# EAGLE design SenseLoRa Industrial-grade Air Monitor V1.0 (EAGLE 6.1)
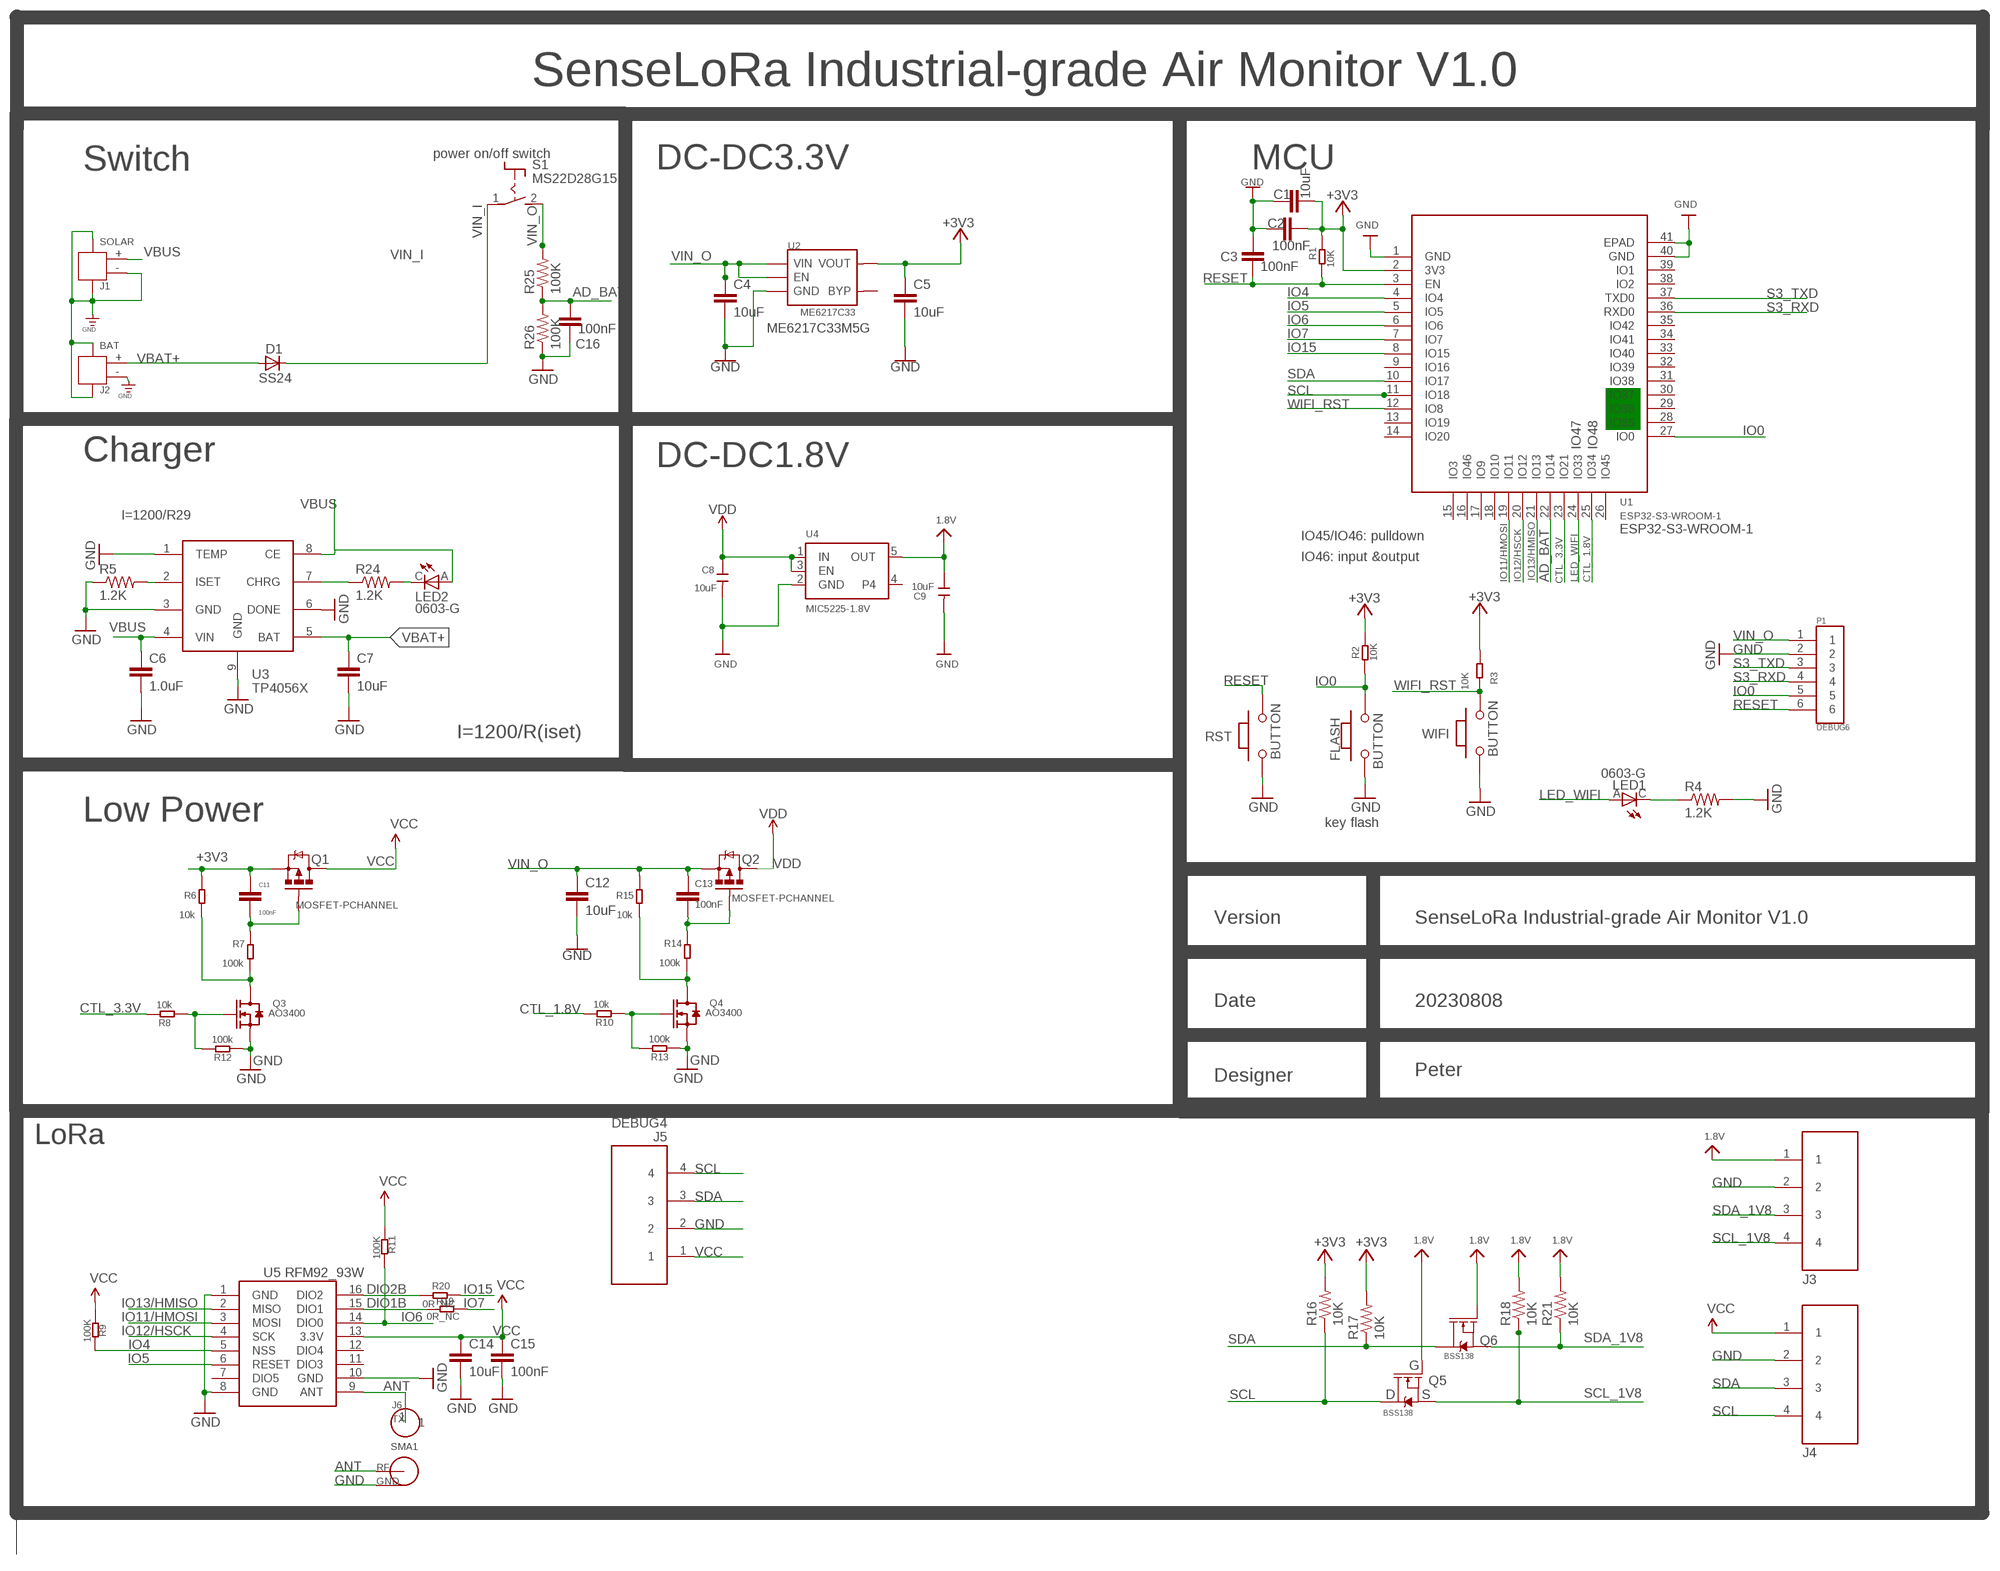
[diagram p0: schematic, sheet 1]

## Parts
C1  10uF  C0603  [C0603]
C2  100nF  C0603  [C0603]
C3  100nF  C0603  [C0603]
C4  10uF  C0603  [C0603]
C5  10uF  C0603  [C0603]
C6  1.0uF  C0603  [C0603]
C7  10uF  C0603  [C0603]
C8  10uF  C-0603  [0603]
C9  10uF  C-0603  [0603]
C11  100nF  C0603  [C0603]
C12  10uF  C0603  [C0603]
C13  100nF  C0603  [C0603]
C14  10uF  C0603  [C0603]
C15  100nF  C0603  [C0603]
C16  100nF  C0603  [C0603]
D1  SS24  DIODE-DO-214AC  [DO-214AC]
FLASH  BUTTON  PB157  [157SW]
J1  SOLAR  JST-2P-SMD'2.0'  [HW2-SMD-2.0-90D]
J2  BAT  JST-2P-SMD'2.0'  [HW2-SMD-2.0-90D]
J3  CONNNECT-SMD-1.25X4P  [CONNNECT-SMD-1.25X4P]
J4  CONNNECT-SMD-1.25X4P  [CONNNECT-SMD-1.25X4P]
J5  DEBUG4  [DEBUG*4]
J6  TX  HEADER-1P-50  [1P-100/50MIL]
LED1  0603-G  LED0603  [LED0603]
LED2  0603-G  LED0603  [LED0603]
P1  DEBUG6  [DEBUG*6]
Q1  MOSFET-PCHANNEL  [SOT23-3]
Q2  MOSFET-PCHANNEL  [SOT23-3]
Q3  AO3400  MOSFET-N'SOT23'  [SOT23@1]
Q4  AO3400  MOSFET-N'SOT23'  [SOT23@1]
Q5  BSS138  MOSFET-NCH-BSS138  [SOT23-3]
Q6  BSS138  MOSFET-NCH-BSS138  [SOT23-3]
R1  10K  R-0603  [R0603]
R2  10K  R-0603  [R0603]
R3  10K  R-0603  [R0603]
R4  1.2K  R0603  [R0603]
R5  1.2K  R0603  [R0603]
R6  10k  R-0603  [R0603]
R7  100k  R-0603  [R0603]
R8  10k  R-0603  [R0603]
R9  100K  R-0603  [R0603]
R10  10k  R-0603  [R0603]
R11  100K  R-0603  [R0603]
R12  100k  R-0603  [R0603]
R13  100k  R-0603  [R0603]
R14  100k  R-0603  [R0603]
R15  10k  R-0603  [R0603]
R16  10K  R0603  [R0603]
R17  10K  R0603  [R0603]
R18  10K  R0603  [R0603]
R19  0R_NC  R-0603  [R0603]
R20  0R_NC  R-0603  [R0603]
R21  10K  R0603  [R0603]
R24  1.2K  R0603  [R0603]
R25  100K  R0603  [R0603]
R26  100K  R0603  [R0603]
RST  BUTTON  PB157  [157SW]
S1  MS22D28G15  [S-MS22D28G15]
SMA1  SMA-KWE  [SMA-KWE]
U1  ESP32-S3-WROOM-1  ESP32­S2­SOLO  [ESP32-­S2-­SOLO]
U2  ME6217C33  SPX3819  [SOT23-5]
U3  TP4056X  TP4056  [SOP8-1.27P]
U4  MIC5225-1.8V  VREG_SOT23-5  [SOT23-5]
U5  RFM92_93W  [RFM92_93W]
WIFI  BUTTON  PB157  [157SW]

## Nets
1.8V: C9.1 J3.1 Q5.1(G) Q6.1(G) R18.2 R21.2 U4.5(OUT)
+3V3: C1.2 C2.2 C5.1 C11.1 Q1.2(S) R1.2 R2.2 R3.2 R6.2 R16.2 R17.2 U1.2(3V3) U2.5(VOUT)
AD_BAT: C16.2 R25.1 R26.2 U1.22(IO14)
ANT: J6.1 SMA1.1(SIG) U5.9(ANT)
CTL_1.8V: R10.2 U1.25(IO34)
CTL_3.3V: R8.2 U1.23(IO21)
DIO1B: R19.2 U5.15(DIO1)
DIO2B: R20.2 U5.16(DIO2)
GND: C1.1 C2.1 C3.2 C4.2 C5.2 C6.2 C7.2 C8.2 C9.2 C12.2 C14.2 C15.2 C16.1 FLASH.1 J1.3 J1.4 J1.- J2.3 J2.4 J2.- J3.2 J4.2 J5.2 P1.2 Q3.2(S) Q4.2(S) R4.2 R5.1 R12.1 R13.1 R26.1 RST.1 SMA1.2(GND) SMA1.3(GND) SMA1.4(GND) SMA1.5(GND) U1.1(GND) U1.40(GND) U1.41(EPAD) U2.2(GND) U3.1(TEMP) U3.3(GND) U3.6(DONE) U3.9(GND) U4.2(GND) U5.1(GND) U5.8(GND) U5.10(GND) WIFI.1
IO0: FLASH.2 P1.5 R2.1 U1.27(IO0)
IO4: R9.1 U1.4(IO4) U5.5(NSS)
IO5: U1.5(IO5) U5.6(RESET)
IO6: R11.1 U1.6(IO6) U5.14(DIO0)
IO7: R19.1 U1.7(IO7)
IO11/HMOSI: U1.19(IO11) U5.3(MOSI)
IO12/HSCK: U1.20(IO12) U5.4(SCK)
IO13/HMISO: U1.21(IO13) U5.2(MISO)
IO15: R20.1 U1.8(IO15)
ISET: R5.2 U3.2(ISET)
LED_WIFI: LED1.A U1.24(IO33)
N$1: LED1.C R4.1
N$4: R24.1 U3.7(CHRG)
N$5: LED2.C R24.2
N$11: C13.2 Q2.1(G) R14.2
N$12: Q4.1(G) R10.1 R13.2
N$13: C11.2 Q1.1(G) R7.2
N$14: Q3.1(G) R8.1 R12.2
N$18: Q3.3(D) R6.1 R7.1
N$31: Q4.3(D) R14.1 R15.1
RESET: C3.1 P1.6 R1.1 RST.2 U1.3(EN)
S3_RXD: P1.4 U1.36(RXD0)
S3_TXD: P1.3 U1.37(TXD0)
SCL: J4.4 J5.4 Q5.3(D) R16.1 U1.11(IO18)
SCL_1V8: J3.4 Q5.2(S) R18.1
SDA: J4.3 J5.3 Q6.3(D) R17.1 U1.10(IO17)
SDA_1V8: J3.3 Q6.2(S) R21.1
VBAT+: C7.1 D1.A J2.+ U3.5(BAT)
VBUS: C6.1 J1.+ LED2.A U3.4(VIN) U3.8(CE)
VCC: C14.1 C15.1 J4.1 J5.1 Q1.3(D) R9.2 R11.2 U5.13(3.3V)
VDD: C8.1 Q2.3(D) U4.1(IN) U4.3(EN)
VIN_I: D1.C S1.1(P)
VIN_O: C4.1 C12.1 C13.1 P1.1 Q2.2(S) R15.2 R25.2 S1.2(S) U2.1(VIN) U2.3(EN)
WIFI_RST: R3.1 U1.12(IO8) WIFI.2
Unconnected: U1.9(IO16) U1.13(IO19) U1.14(IO20) U1.15(IO3) U1.16(IO46) U1.17(IO9) U1.18(IO10) U1.26(IO45) U1.28(IO35) U1.29(IO36) U1.30(IO37) U1.31(IO38) U1.32(IO39) U1.33(IO40) U1.34(IO41) U1.35(IO42) U1.38(IO2) U1.39(IO1) U2.4(BYP) U4.4 U5.7(DIO5) U5.11(DIO3) U5.12(DIO4)

## Notes on the sheet
- SenseLoRa Industrial-grade Air Monitor V1.0
- power on/off switch
- Switch | DC-DC3.3V | MCU
- ME6217C33M5G
- IO47 | IO48
- Charger | DC-DC1.8V
- I=1200/R29
- ESP32-S3-WROOM-1
- IO45/IO46: pulldown
- IO46: input &output
- I=1200/R(iset)
- Low Power
- key flash
- Version | SenseLoRa Industrial-grade Air Monitor V1.0
- Date | 20230808
- Peter
- Designer
- LoRa
- G
- D | S

## Library data of the parts
C1-C7 C11-C16 = Makerfabs-Peter:C0603
C8 C9 = Discrete:C*: Ceramic Capacitors
D1 = diode:DIODE-: DIODE
FLASH RST WIFI = MySMD:PB157
J1 J2 = Connector-new:JST-2P-SMD: 2P-SMD-1.0-90D:320110054;2P-SMD-2.0-90D:320110026
J3 J4 = Makerfabs-Peter:CONNNECT-SMD-1.25X4P
J5 = Makerfabs-Peter:DEBUG*4
J6 = Connector:HEADER-1P
LED1 LED2 = Makerfabs-Peter:LED0603
P1 = Makerfabs-Peter:DEBUG*6
Q1 Q2 = User-Submitted:MOSFET-PCHANNEL: Generic PMOSFET IRLML2244 - TRANS-11153 (SOT-23 -20V -4.3A) (1.Gate 2.Source 3.Drain) FQP27P06 - COM-10349 <http://www.sparkfun.com/products/10349> (TO-220 -60V -27A) (1.Gate 2.Source 3.Drain); PROD_ID: TRANS-08285
Q3 Q4 = Discrete:MOSFET-N: IRLL014: http://www.vishay.com/docs/91319/sihll014.pdf
Q5 Q6 = SparkFun-DiscreteSemi:MOSFET-NCH: N-channel MOSFETs Voltage controlled devices that allow control of high current outputs. SparkFun Products: SparkFun OpenScale <https://www.sparkfun.com/products/13261> SparkFun Digital Sandbox <https://www.sparkfun.com/products/12651> SparkFun Monster Moto Shield <https://www.sparkfun.com/products/10182> SparkFun MOSFET Power Controller <https://www.sparkfun.com/products/11214>; PROD_ID: TRANS-00830; VALUE: 220mA/50V/3.5Ω
R1-R3 R6-R15 R19 R20 = Discrete:R*
R4 R5 R16-R18 R21 R24-R26 = Makerfabs-Peter:R0603
S1 = Makerfabs-Peter:MS22D28G15
SMA1 = dragino:SMA-KWE
U1 = self:ESP32­S2­SOLO
U2 = IC:SPX3819
U3 = self:TP4056
U4 = microbuilder:VREG_SOT23-5: SOT23-5 Fixed Voltage Regulators Part Current Out V Out V In V Dropout θJA (°C/W) TJ (°C) Digikey Part No. ADP121 150mA 3.3V 3.4-5.5V 0.09V @ 150mA -- -- ADP121-AUJZ33R7CT-ND ADP121 150mA 3.0V 3.1-5.5V 0.09V @ 150mA -- -- ADP121-AUJZ30R7CT-ND ADP122 300mA 3.3V 3.4-5.5V 0.085V @ 300mA -- -- ADP122AUJZ-3.3-R7CT-ND ADP1712 300mA 3.3V 3.5-5.5V 0.17V @ 300mA -- -- ADP1712AUJZ-3.3-R7TR-ND AP7311 (Low Cost) 150mA 3.3V 3.5-6V 0.15V @ 150mA -- -- AP7311-33WG-7DICT-ND LD39015M18R 150mA 1.8V 1.9V-5.5V 0.08V @ 100mA -- -- 497-6977-1-ND LP2985A-33DBVR 150mA 3.3V 3.3-16V 0.28V @ 150mA 206 150 296-18479-1-ND MCP1824T-3302E/OT 300mA 3.3V 3.5V-6V 0.2V @ 300mA -- -- MCP1824T-3302E/OTCT-ND MIC5205-2.5YM5 TR 150mA 2.5V 2.7-16V 0.165V @ 150mA -- -- 576-1257-2-ND MIC5205-3.0YM5 TR 150mA 3.0V 3.2V-16V 0.165V @ 150mA -- -- 576-1258-2-ND MIC5205-3.3YM5 TR 150mA 3.3V 3.5V-16V 0.165V @ 150mA -- -- 576-1259-2-ND TPS780330220 150mA 3.3V+2.2V 3.6-5.5V 250mV Max -- -- 296-23332-1-ND TDA3663/N1,135 100mA 3.3V 3.5-45V 0.18V @ 50mA -- -- 568-5343-1-ND Max operating temp can be calculated using θJA, TJ (max junction temperature), and power in watts. Set the "Maximum Ambient Temperature" until it reaches TJ ("Max Junction Temperature"), which is the absolute limit for safe use of the regulator: Heat Sink Temperature Calculator <http://www.daycounter.com/Calculators/Heat-Sink-Temperature-Calculator.phtml> For example, With 12V source into a 3.3V LP2985 and a 30mA load, we are dissipating (12V-3.3V) * 0.03A = 0.261W. With a θJA of 206 °C/W, a TJ of 150°C, and 261mW we can safely use the chip without a heat sink up to 75°C (=147.1°C Junction Temperature).
U5 = dragino:RFM92_93W

## Net classes
0 default: width 0.152 mm, drill 0.254 mm, clearance 0.152 mm

## Board
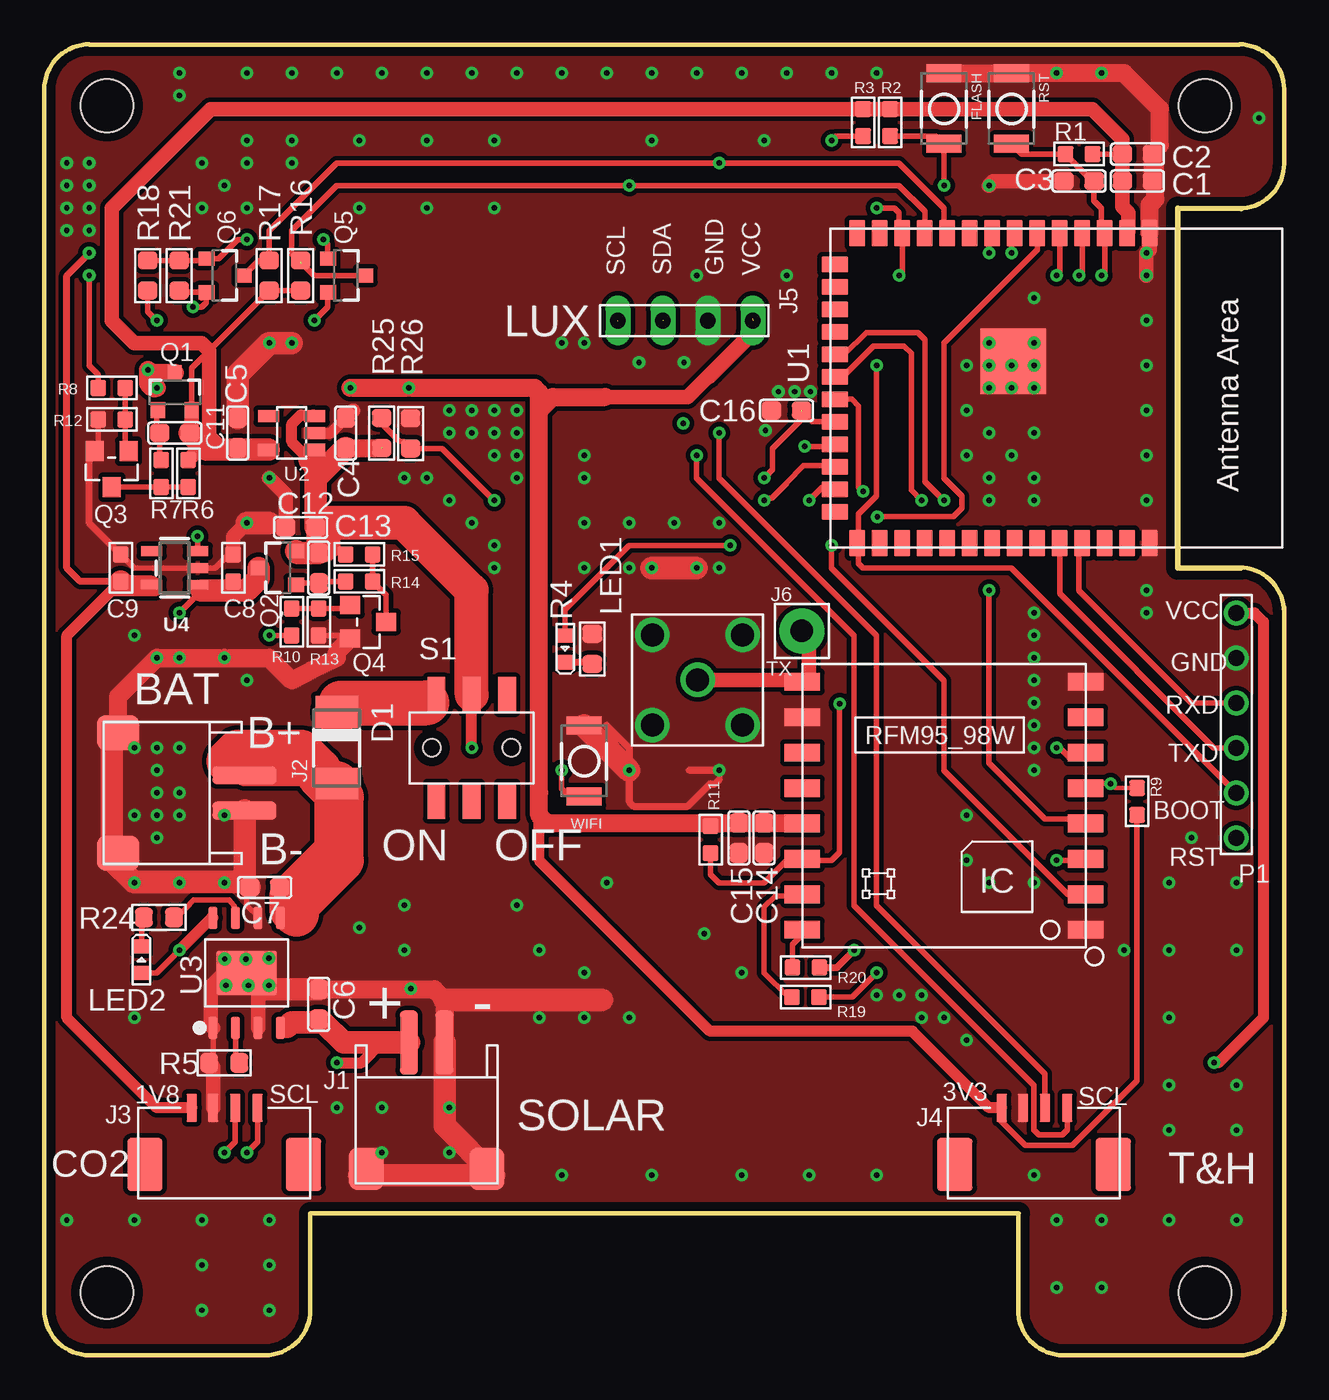
[diagram p1: board, top side]
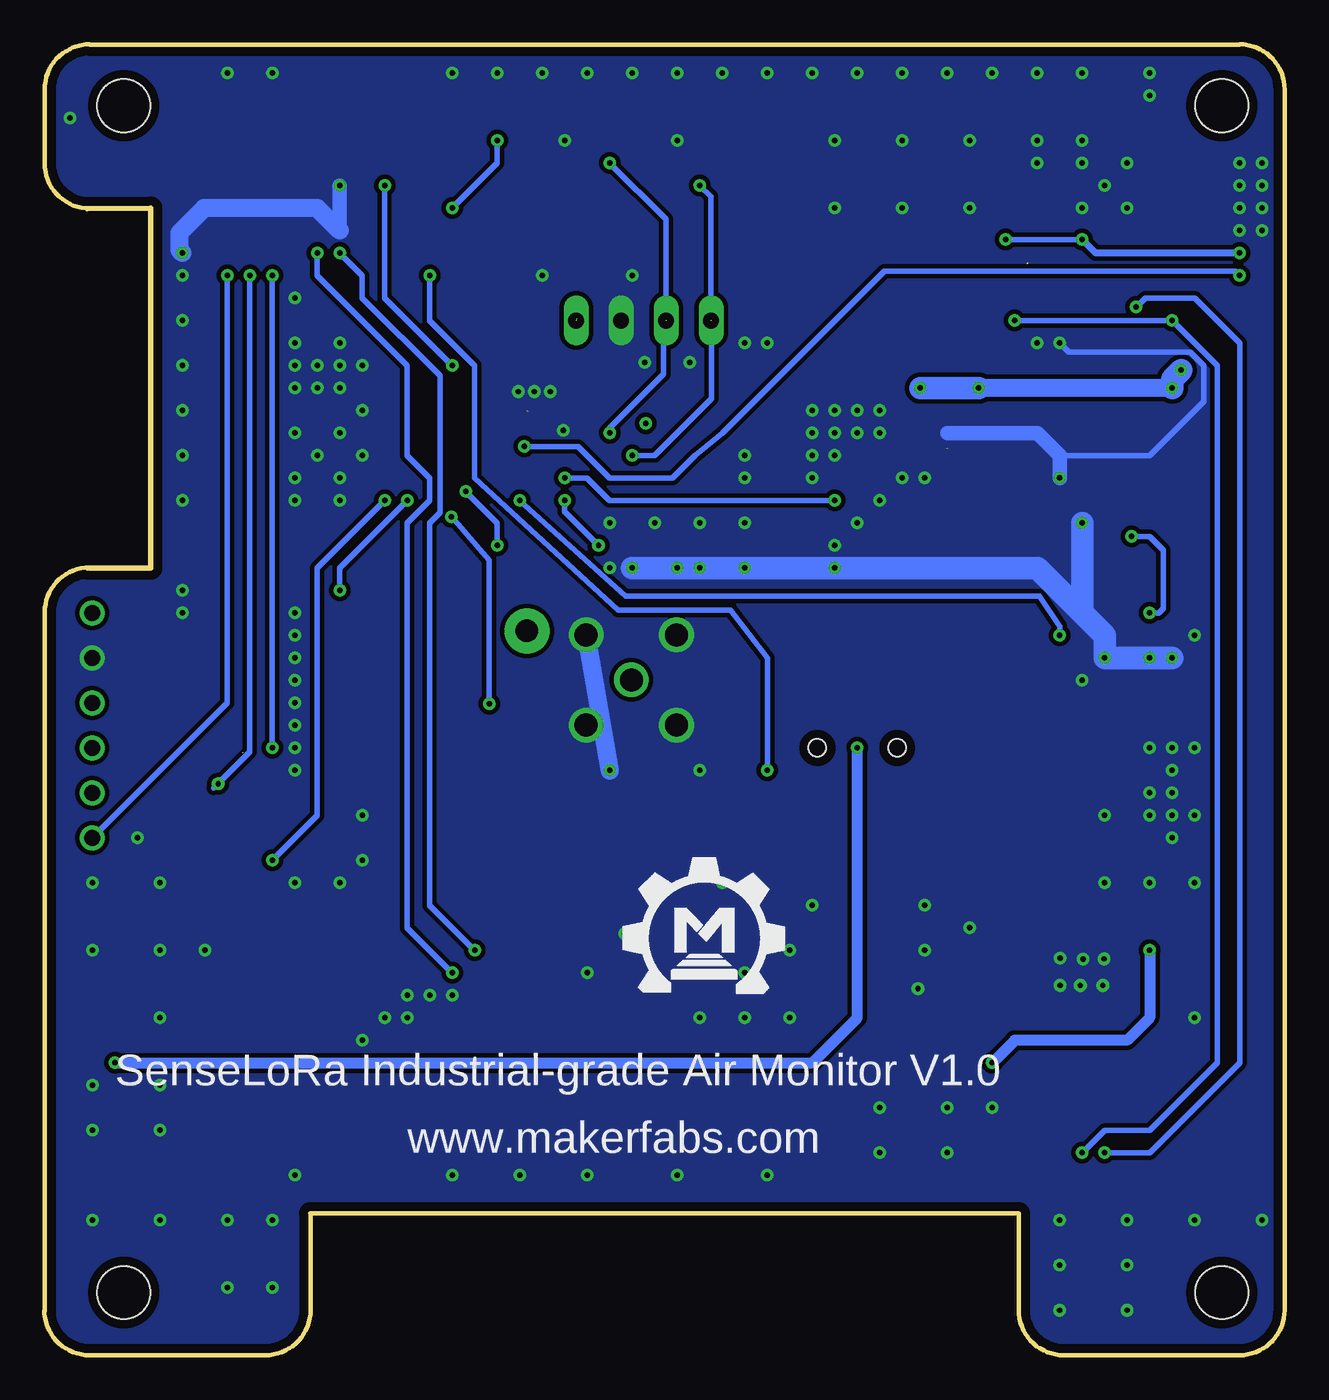
[diagram p2: board, bottom side, seen from below]

Size 70.03 x 74.02 mm. Coordinates in mm from the lower left corner, seen from the top.
Outline: 67.46,74 2.54,74
Outline: 70.03,2.54 arc-90 67.49,0 57.53,0 arc-90 54.99,2.54
Outline: 70,71.48 arc90 67.46,74.02
Outline: 2.54,74.02 arc90 0,71.48 0,2.54 arc90 2.54,0 12.47,0 arc90 15.01,2.54
Outline: 70,42.24 70,2.49
Outline: 15,2.54 15,8
Outline: 55,2.54 55,8
Outline: 15.03,8 55.02,8
Outline: 67.59,64.75 64.01,64.77 64.01,44.45 67.56,44.45
Outline: 67.46,64.75 arc90 70,67.28
Outline: 70,41.94 arc90 67.46,44.48
Outline: 70,71.45 70,67.26
Copper layers (1*16): Top 0.035mm / dielectric 1.5mm / Bottom 0.035mm
Design rules: minimum track width 8mil, minimum drill 12mil, track to track 8mil, track to pad 8mil, pad to pad 8mil, via to via 8mil, smd to smd 0mil, copper to edge 20mil, drill to drill 8mil, minimum pad ring 10mil, minimum via ring 8mil, stop-mask expansion 0mil, vias tented up to drill 30mil, thermal gap 0mil
Holes 3 mm at 3.54,3.54 65.54,3.54 3.54,70.54 65.54,70.54

### Footprints (pad centres in the part's own frame; a part is rotated, then mirrored left to right if it is on the bottom)
C0603 = smd 1.1 x 1: 1 -0.85,0; 2 0.85,0
0603 = smd 0.889 x 0.889: 1 -0.762,0; 2 0.762,0
DO-214AC = smd 1.8 x 2.4: A 2.025,0; C -2.025,0
157SW = smd 1.016 x 1.981: 1 0,0; 2 4,0
HW2-SMD-2.0-90D = smd 2 x 2.4: 3 3.4,-2.181; 4 -3.4,-2.181 | smd 1 x 3.6: + -1,4.953; - 1,4.953
CONNNECT-SMD-1.25X4P = smd 0.6 x 1.6: 1 -1.825,2.54; 2 -0.625,2.54; 3 0.625,2.54; 4 1.875,2.54 | smd 2 x 3: 5 4.475,-0.66; 6 -4.475,-0.66
DEBUG*4 = drill 0.9 long: 1 0,0; 2 0,-2.54; 3 0,-5.08; 4 0,-7.62
1P-100/50MIL = drill 1.27 pad 2.54: 1 0,0
LED0603 = smd 0.8 x 0.8: A -0.75,0; C 0.75,0
DEBUG*6 = drill 0.9: 1 0,0; 2 0,2.54; 3 0,5.08; 4 0,7.62; 5 0,10.16; 6 0,12.7
SOT23-3 = smd 0.8 x 0.9: 1 -0.95,-1; 2 0.95,-1; 3 0,1.1
SOT23@1 = smd 1.016 x 1.143: 1 -0.95,-1.016; 2 0.95,-1.016; 3 0,1.016
R0603 = smd 0.889 x 0.889: 1 -0.762,0; 2 0.762,0
R0603' = smd 1 x 1.1: 1 -0.85,0; 2 0.85,0
S-MS22D28G15 = smd 1 x 2: 1 -2,3; 2 0,3; 3 2,3; 4 2,-3; 5 0,-3; 6 -2,-3 | hole 1: 2.25,0; -2.25,0
SMA-KWE = drill 1.3: 1 0,0; 2 -2.55,2.55; 3 2.55,2.55; 4 -2.55,-2.55; 5 2.55,-2.55
ESP32-­S2-­SOLO = smd 1.5 x 0.9: 1 -8.75,5.26; 2 -8.75,3.99; 3 -8.75,2.72; 4 -8.75,1.45; 5 -8.75,0.18; 6 -8.75,-1.09; 7 -8.75,-2.36; 8 -8.75,-3.63; 9 -8.75,-4.9; 10 -8.75,-6.17; 11 -8.75,-7.44; 12 -8.75,-8.71; 13 -8.75,-9.98; 14 -8.75,-11.25; 27 8.75,-11.25; 28 8.75,-9.98; 29 8.75,-8.71; 30 8.75,-7.44; 31 8.75,-6.17; 32 8.75,-4.9; 33 8.75,-3.63; 34 8.75,-2.36; 35 8.75,-1.09; 36 8.75,0.18; 37 8.75,1.45; 38 8.75,2.72; 39 8.75,3.99; 40 8.75,5.26 | smd 0.9 x 1.5: 15 -6.985,-12.5; 16 -5.715,-12.5; 17 -4.445,-12.5; 18 -3.175,-12.5; 19 -1.905,-12.5; 20 -0.635,-12.5; 21 0.635,-12.5; 22 1.905,-12.5; 23 3.175,-12.5; 24 4.445,-12.5; 25 5.715,-12.5; 26 6.985,-12.5 | smd 3.7 x 3.7: 41 -1.5,-2.46
SOT23-5 = smd 0.69 x 1.2: 1 -0.95,-1.3; 2 0,-1.3; 3 0.95,-1.3; 4 0.95,1.3; 5 -0.95,1.3
SOP8-1.27P = smd 1.27 x 0.51: 1 -3.1,1.905; 2 -3.1,0.635; 3 -3.1,-0.635; 4 -3.1,-1.905; 5 3.1,-1.905; 6 3.1,-0.635; 7 3.1,0.635; 8 3.1,1.905 | smd 2.5 x 3.4: 9 0,0
SOT23-5' = smd 0.55 x 1.2: 1 -0.95,-1.3; 2 0,-1.3; 3 0.95,-1.3; 4 0.95,1.3; 5 -0.95,1.3
RFM92_93W = smd 2 x 1: 1 -8,7; 2 -8,5; 3 -8,3; 4 -8,1; 5 -8,-1; 6 -8,-3; 7 -8,-5; 8 -8,-7; 9 8,-7; 10 8,-5; 11 8,-3; 12 8,-1; 13 8,1; 14 8,3; 15 8,5; 16 8,7

### Placement (x,y rotation side)
C1  61.72,66.29 180 top
C2  61.72,67.82 180 top
C3  58.42,66.29 180 top
C4  17.02,52.07 90 top
C5  10.92,52.07 90 top
C6  15.49,19.81 90 top
C7  12.45,26.42 180 top
C8  10.67,44.45 90 top
C9  4.32,44.45 90 top
C11  7.37,52.07 180 top
C12  14.48,46.74 180 top
C13  15.49,44.45 270 top
C14  40.64,29.21 270 top
C15  39.22,29.21 270 top
C16  41.91,53.34 0 top
D1  16.51,34.29 270 top
FLASH  50.8,72.39 270 top
J1  21.59,12.7 0 top
J2  6.35,31.75 270 top
J3  10.16,11.43 0 top
J4  55.88,11.43 0 top
J5  40,58.42 270 top
J6  42.77,40.89 0 top
LED1  29.41,39.88 270 top
LED2  5.49,22.33 90 top
P1  67.31,41.91 180 top
Q1  7.37,54.36 0 top
Q2  13.21,44.45 90 top
Q3  3.81,50.04 180 top
Q4  18.29,41.4 270 top
Q5  17.02,60.96 270 top
Q6  10.16,60.96 270 top
R1  58.42,67.82 0 top
R2  47.75,69.6 90 top
R3  46.23,69.6 90 top
R4  1.2K  [R0603']  30.94,39.88 90 top
R5  1.2K  [R0603']  10.16,16.51 0 top
R6  8.13,49.78 90 top
R7  6.6,49.78 90 top
R8  3.81,54.61 180 top
R9  61.7,31.27 270 top
R10  13.97,41.4 270 top
R11  37.62,29.11 90 top
R12  3.81,52.83 0 top
R13  15.49,41.4 90 top
R14  17.78,43.69 180 top
R15  17.78,45.21 180 top
R16  10K  [R0603']  14.48,60.96 270 top
R17  10K  [R0603']  12.7,60.96 270 top
R18  10K  [R0603']  5.84,60.96 90 top
R19  42.98,20.22 180 top
R20  43,21.89 180 top
R21  10K  [R0603']  7.62,60.96 90 top
R24  1.2K  [R0603']  6.48,24.71 180 top
R25  100K  [R0603']  19.05,52.07 270 top
R26  100K  [R0603']  20.68,52.04 270 top
RST  54.61,72.39 270 top
S1  24.13,34.29 0 top
SMA1  36.88,38.13 0 top
U1  57.15,54.61 270 top
U2  13.97,52.07 90 top
U3  11.43,21.59 90 top
U4  MIC5225-1.8V  [SOT23-5']  7.37,44.45 90 top
U5  50.8,31.02 180 top
U$2  [MAKERFABS_0.3]  36.89,20.48 0 bottom
WIFI  30.48,35.56 270 top

### Tracks (layer width: path | path; a pad name or v marks a point on that pad's centre or on a via)
1.8V  (via drill 0.3)
  Top 0.203: U4.5 6.07,43.46 6.35,43.18
  Top 0.305: R18.2 R21.2 9.06,61.81 Q6.1 9.84,61.91 10.92,62.99 v11.43,62.99 | v15.75,62.99 16,62.74 16,61.98 16.02,61.96 Q5.1
  Top 0.406: C9.1 2.03,43.69 1.27,44.45 1.27,60.96 v2.54,62.23
  Top 0.61: J3.1 6.35,13.97 1.27,19.05 1.27,40.64 3.81,43.18 6.35,43.18
  Top 1.016: U4.5 4.51,43.5
  Top 1.27: 4.51,43.5 C9.1
  Bottom 0.305: v11.43,62.99 v15.75,62.99
  Bottom 0.406: v2.54,62.23 10.67,62.23 v11.43,62.99
+3V3
  Top 0.305: C5.1 10.5,50.8 8.89,50.8 8.32,51.37 Q1.2 8.32,55.73 9.31,56.73 R17.2 R16.2 | U1.2 61.1,63.36 60.96,63.5 60.96,64.77 60.96,66.21 C1.2 | C2.2 R1.2
  Top 0.813: 9.17,51.12 8.7,51.12 R6.2 | Q1.2 8.32,52.17 C11.1 | U1.2 61.21,63.43 61.21,64.52 60.96,64.77 60.87,64.86 C1.2 C2.2 60.87,68.67 59.18,70.36 R2.2 R3.2 9.4,70.36 3.81,64.77 3.81,58.42 5.08,57.15 8.89,57.15 9.31,56.73 9.31,51.9 9.91,51.31
  Top 1.27: U2.5 9.17,51.12 C11.1
AD_BAT  (via drill 0.3)  (1 unrouted)
  Top 0.305: U1.22 43.33,52.7 42.72,53.31 | C16.2 42.76,52.82 41.12,51.18 41.12,50.01 v40.64,49.53 | R25.1 19.1,52.55 20.04,51.61 20.28,51.59 R26.2 22.46,51.2 v25.4,48.26
  Bottom 0.305: v40.64,49.53 39.37,49.53 38.1,48.26 v25.4,48.26
ANT
  Top 0.203: U5.9 42.85,38.02 42.95,38.12 | 42.72,41.02 42.72,40.95 J6.1
  Top 0.813: SMA1.1 42.95,38.12 43.16,38.12 43.18,38.1 43.18,40.64 43.1,40.64 42.72,41.02
CTL_1.8V  (via drill 0.3)
  Top 0.305: R10.2 v12.7,40.64 | v43.18,48.26 43.94,49.02 44.52,49.02 U1.25
  Bottom 0.305: v12.7,40.64 12.7,41.15 13.84,42.85 37.21,42.85 v43.18,48.26
CTL_3.3V  (via drill 0.3)
  Top 0.305: R8.2 3.05,55.37 2.54,55.88 v2.54,60.96 | v42.93,51.31 44.78,51.31 | 44.96,51.31 44.78,51.31 | 44.78,51.31 U1.23
  Bottom 0.305: v2.54,60.96 2.79,61.21 22.61,61.21 31.75,52.07 33.27,50.8 34.54,49.53 38.1,49.53 39.88,51.31 v42.93,51.31
DIO1B
  Top 0.305: R19.2 42.01,20.22 40.64,21.59 40.64,25.3 41.27,25.93 42.71,25.93 U5.15
DIO2B
  Top 0.203: U5.16 43.07,24.02 43.18,24.13
  Top 0.305: R20.2 42.24,23.19 43.18,24.13
GND  (via drill 0.3)
  Top 0.305: U3.1 9.53,16.73 R5.1 | U3.6 12.06,24.77 11.43,25.4 11.43,26.25 C7.2 | 10.79,22.23 U3.9 | C8.2 10.41,45.21 9.65,44.45 U4.2 5.08,44.45 C9.2 | R13.1 17.08,40.64 Q4.2 | R12.1 3.05,51.24 Q3.2 | 62.74,66.29 C1.1 62.57,66.97 62.23,67.31 62.23,66.04 62.74,66.04 62.99,66.29 62.99,68.33 | J1.4 18.69,10.52 19.05,10.16 | J1.3 25.04,10.52 25.4,10.16 | 3.81,27.94 3.81,27.99 J2.3 | C12.2 12.95,46.74 12.7,46.99 | 38.11,32.51 v38.11,33.01 v38.1,33.02
  Top 0.406: C9.2 2.54,46.99 2.54,50.73 Q3.2 | v38.1,33.02 36.41,33.02 | v33.02,33.02 31.75,35.56 33.02,34.29 v33.02,33.02 | v33.02,33.02 33.02,31.24 33.27,30.99 36.32,30.99 37.59,32.26 37.86,32.26 38.11,32.51
  Top 0.61: U2.2 16.17,52.07 C4.2
  Top 0.813: U3.3 12.06,20.95 U3.9 10.16,21.59 9.4,20.83 9.4,18.62 U3.1 | J3.2 9.54,16.29 R5.1 | C8.2 10.67,46.23 v11.43,46.99 | C12.2 13.63,48.6 v12.7,49.53 | 17.44,53.34 C4.2 | U1.1 62.41,62.41 v62.23,62.23 v62.23,60.96 | C3.2 53.59,66.29 v53.34,66.04
  Top 1.016: C6.2 22.01,20.66 22.61,20.07 22.61,17.67 J1.- | U1.1 62.41,64.95 62.74,65.28 62.74,66.29 62.74,67.65 C2.1 | J2.4 4.17,37.19 v6.35,39.37 v10.16,39.37 12.7,39.37 13.97,38.1 15.09,38.68 16.51,39.37 16.51,39.69 Q4.2 | 62.99,68.33 62.99,70.36 60.96,72.39 RST.1 FLASH.1
  Top 1.27: C6.2 12.36,20.66 U3.9 | J2.- 11.3,26.71 | 11.3,26.71 C7.2 | J1.- 22.59,12.97 25.4,10.16 19.05,10.16 17.78,10.16 | 22.61,20.07 31.5,20.07 | 11.3,26.71 5.04,26.71 3.81,27.94 3.81,34.79 J2.4 | v11.43,46.99 12.7,46.99 | C5.2 10.92,55.37 v12.7,57.15 v13.97,57.15 | WIFI.1 v33.02,33.02 | v34.29,44.45 v36.83,44.45
  Bottom 0.305: 12.7,50.8 7.62,50.8 4.57,53.85 4.57,55.88 5.33,56.64 12.19,56.64 v12.7,57.15
  Bottom 0.813: v12.7,49.53 12.7,50.8 13.97,52.07 19.05,52.07 | v53.34,66.04 53.34,63.5
  Bottom 1.016: 53.34,63.5 54.61,64.77 61,64.77 U1.1 62.41,62.41 v62.23,62.23 | SMA1.3 v38.11,33.01 v38.1,33.02
  Bottom 1.27: 11.43,41.91 13.97,44.45 v36.83,44.45 | v11.43,46.99 11.43,41.91 | 11.43,41.91 10.16,40.64 v10.16,39.37 v6.35,39.37
  other vias: 55.88,57.15 55.88,55.88 55.88,54.61 54.61,54.61 53.34,54.61 53.34,55.88 54.61,55.88 52.07,55.88 52.07,53.34 52.07,50.8 55.88,48.26 53.34,49.53 53.34,52.07 55.88,52.07 55.88,49.53 55.88,59.69 53.34,57.15 54.61,50.8 53.34,48.26 63.5,26.67 67.31,26.67 67.31,22.86 63.5,22.86 63.5,19.05 67.31,15.24 63.5,15.24 63.5,12.7 67.31,12.7 67.31,7.62 63.5,7.62 59.69,7.62 59.69,3.81 30.48,21.59 27.94,22.86 20.32,22.86 20.32,25.4 17.78,24.13 5.08,19.05 1.27,7.62 5.08,7.62 8.89,7.62 12.7,7.62 12.7,5.08 8.89,5.08 8.89,2.54 12.7,2.54 19.05,11.43 22.86,11.43 22.86,13.97 19.05,13.97 29.21,10.16 34.29,10.16 39.37,10.16 43.18,10.16 46.99,10.16 55.88,10.16 5.08,30.48 7.62,30.48 7.62,34.29 5.08,34.29 5.08,40.64 7.62,39.37 11.43,38.1 10.16,30.48 7.62,26.67 5.08,26.67 10.16,26.67 16.51,13.97 7.62,31.75 6.35,31.75 20.7,20.7 6.35,33.02 6.35,30.48 6.35,29.21 6.35,34.29 30.48,46.99 33.02,46.99 33.02,44.45 30.48,44.45 38.1,46.99 38.1,44.45 35.56,46.99 30.48,49.53 26.67,72.39 29.21,72.39 31.75,72.39 34.29,72.39 36.83,72.39 39.37,72.39 41.91,72.39 44.45,72.39 24.13,72.39 21.59,72.39 19.05,72.39 16.51,72.39 13.97,72.39 11.43,72.39 7.62,72.39 7.62,71.12 2.54,67.31 2.54,66.04 2.54,64.77 2.54,63.5 1.27,63.5 1.27,64.77 1.27,66.04 1.27,67.31 46.99,72.39 57.15,72.39 59.69,72.39 68.58,69.85 17.78,68.58 21.59,68.58 25.4,68.58 34.29,68.58 40.64,68.58 25.4,64.77 21.59,64.77 17.78,64.77 8.89,67.31 11.43,67.31 13.97,67.31 13.97,68.58 11.43,68.58 8.89,64.77 11.43,64.77 10.16,66.04 37.26,23.8 10.19,22.38 11.38,22.35 12.67,22.43 12.67,20.88 11.53,20.88 10.26,20.88 29.21,57.15 30.48,57.15 36.83,60.96 36.12,56.06 41.91,60.96 52.07,30.48 52.07,27.94 53.34,26.67 55.88,26.67 60.96,22.86 64.77,29.21 62.23,43.18 62.23,41.91 31.75,26.67 26.67,25.4 30.48,19.05 27.94,19.05 33.02,19.05 39.37,21.59 57.15,7.62 57.15,3.81 25.4,52.07 33.58,56.06 40.72,52.22 41.45,54.41 42.37,54.41 43.26,54.41 25.4,44.45 25.4,45.72 22.86,48.26 20.32,49.53 21.59,49.53 22.86,52.07 22.86,53.34 24.13,53.34 25.4,53.34 26.67,53.34 26.67,52.07 26.67,50.8 26.67,49.53 25.4,50.8 24.13,52.07 30.48,50.8 24.13,46.99 52.07,17.78 50.8,19.05 49.53,19.05 49.53,20.32 48.26,20.32 46.99,20.32 55.88,41.91 55.88,40.64 55.88,39.37 55.88,38.1 55.88,36.83 55.88,35.56 55.88,34.29 55.88,33.02 62.23,58.42 62.23,55.88 62.23,53.34 62.23,50.8 62.23,48.26
  pour Top (isolate 0.254, rank 6): -1.27,76.2 -1.27,-3.81 72.39,-3.81 72.39,-1.27 72.39,76.2
  pour Bottom (isolate 0.254, rank 6): -5.08,78.74 -5.08,-7.62 76.2,-7.62 76.2,-6.35 76.2,80.01 -5.08,80.01
IO0  (via drill 0.3)
  Top 0.305: P1.5 54.61,44.45 46.23,44.45 45.97,44.7 45.97,45.79 U1.27 | 45.72,45.68 U1.27 | v50.8,66.04 FLASH.2 50.35,68.83 R2.1 | v46.99,55.88 46.99,48.51 45.97,47.5 45.97,45.93 U1.27
  Bottom 0.305: v50.8,66.04 50.8,59.69 v46.99,55.88
IO4  (via drill 0.3)
  Top 0.203: R9.1 61.67,32.05
  Top 0.254: 61.64,32.02 60.46,32.02 v60.21,32.27
  Top 0.305: U1.4 58.6,61.14 v58.42,60.96 | v60.21,32.27 59.05,32.27 U5.5
  Top 0.406: 61.64,32.02 61.67,32.05
  Bottom 0.305: v58.42,60.96 58.42,34.06 v60.21,32.27 60.45,32.03
IO5  (via drill 0.3)  (1 unrouted)
  Top 0.305: U1.5 57.33,61.14 v57.15,60.96 | v57.15,34.29 57.33,34.29 57.94,33.68 58.47,33.68 58.83,34.04
  Bottom 0.305: v57.15,60.96 v57.15,34.29
IO6  (via drill 0.3)
  Top 0.203: 43.18,27.94 42.88,27.94 U5.14
  Top 0.305: R11.1 37.62,27.15 38.1,26.67 40.64,26.67 41.91,27.94 43.18,27.94 44.45,27.94 44.91,28.4 v44.91,36.78 | U1.6 56.06,62.41 50.8,57.15 50.8,49.53 51.82,48.51 51.82,47.83 51.33,47.35 v47.04,47.35
  Bottom 0.305: v44.91,36.78 44.91,44.91 v47.04,47.35
IO7  (via drill 0.3)
  Top 0.305: R19.1 45.62,20.22 v46.99,21.59 | v54.61,62.23 54.61,63.18 U1.7
  Bottom 0.305: v46.99,21.59 49.53,24.13 49.53,46.99 48.26,48.26 48.26,49.53 49.53,50.8 49.53,55.88 54.61,60.96 v54.61,62.23
IO11/HMOSI  (via drill 0.3)
  Top 0.203: U5.3 58.5,28.02 58.42,27.94
  Top 0.305: 44.27,56.52 U1.19 45.19,56.52 46.41,57.73 49.33,57.73 49.73,57.33 49.73,49.33 v50.8,48.26 | v57.15,27.94 58.42,27.94
  Bottom 0.305: v50.8,48.26 54.61,44.45 54.61,30.48 v57.15,27.94
IO12/HSCK  (via drill 0.3)
  Top 0.305: U1.20 45.09,55.24 46.81,56.97 48.54,56.97 48.95,56.57 48.95,48.84 v49.53,48.26 | v53.34,43.18 53.34,33.43 56.49,30.28 58.54,30.28 U5.4
  Bottom 0.305: v49.53,48.26 53.34,44.45 v53.34,43.18
IO13/HMISO  (via drill 0.3)
  Top 0.305: U1.21 45.59,53.98 45.97,53.59 45.97,49.02 v46.23,48.77 | v44.45,45.72 44.45,44.45 50.8,38.1 50.8,33.02 57.8,26.02 U5.2
  Bottom 0.305: v44.45,45.72 44.45,46.99 v46.23,48.77
IO15  (via drill 0.3)
  Top 0.203: 53.34,63.5 53.38,63.5 U1.8
  Top 0.305: v53.34,62.23 53.34,63.5
  Top 0.406: R20.1 44.76,21.89 v45.72,22.86
  Bottom 0.305: v45.72,22.86 48.26,25.4 48.26,46.99 47.68,47.57 47.68,55.3 52.07,59.69 52.07,60.96 v53.34,62.23
ISET
  Top 0.305: U3.2 10.79,16.73 R5.2
LED_WIFI  (via drill 0.3)
  Top 0.305: LED1.A 29.41,42.11 33.02,45.72 38.1,45.72 v38.73,45.72 | U1.24 44.6,50.22 42.88,50.22 41.91,49.25 41.91,49.23 41.07,48.39 40.77,48.39 v40.64,48.26
  Bottom 0.305: v40.64,48.26 40.64,47.62 v38.73,45.72
N$1
  Top 0.203: R4.1 30.96,39.01
  Top 0.406: LED1.C 30.85,39.13 30.96,39.01
N$2  (via drill 0.3)
  other vias: 36.07,52.6
N$4
  Top 0.305: R24.1 7.49,24.71 8.43,25.7 10.44,25.7 10.72,25.38 10.72,24.77 U3.7
N$5
  Top 0.305: LED2.C 5.49,24.57 R24.2
N$11
  Top 0.305: R14.2 15.58,43.69 C13.2 14.31,43.6 Q2.1
N$12
  Top 0.305: R10.1 R13.2 17.08,42.16 Q4.1
N$13
  Top 0.305: R7.2 6.52,50.63 C11.2 6.35,52.24 6.35,53.34 6.37,53.36 Q1.1
N$14
  Top 0.305: R8.1 R12.2 4.57,51.24 Q3.1
N$18
  Top 0.305: Q3.3 R7.1 R6.1
N$31
  Top 0.305: Q4.3 19.3,42.93 R14.1 R15.1
RESET  (via drill 0.3)
  Top 0.305: RST.2 55.18,67.82 R1.1 59.18,66.29 C3.1 59.27,65.19 59.69,64.77 59.69,63.54 U1.3 59.87,61.14 v59.69,60.96
  Bottom 0.305: v59.69,60.96 59.69,36.83 P1.6
S3_RXD
  Top 0.305: U1.36 57.33,43 66.04,34.29 P1.4
S3_TXD
  Top 0.305: P1.3 64.77,36.83 58.42,43.18 58.42,45.68 U1.37
SCL  (via drill 0.3)  (2 unrouted)
  Top 0.305: R16.1 14.48,61.72 15.24,60.96 Q5.3 | U1.11 49.71,64.59 48.26,66.04 v33.02,66.04 16.51,66.04 13.97,63.5 13.97,62.18 14.53,61.62 | v36.83,50.8 36.83,49.53 45.72,40.64 45.72,25.4 55.88,15.24 55.88,12.7 55.91,12.7 56.16,12.45 57.48,12.45 57.76,12.72 J4.4
  Bottom 0.305: v36.83,50.8 35.56,50.8 32.36,54 32.36,58.42 | J5.4 32.38,65.4 v33.02,66.04
SCL_1V8  (via drill 0.3)
  Top 0.305: R18.1 5.84,58.93 v6.35,58.42 | v15.24,58.42 16,59.18 16,59.99 Q5.2 | J3.4 12.04,12.04 v11.43,11.43
  Bottom 0.305: v15.24,58.42 v6.35,58.42 3.81,55.88 3.81,16.51 7.62,12.7 10.16,12.7 v11.43,11.43
SDA  (via drill 0.3)  (1 unrouted)
  Top 0.305: Q6.3 12.11,61.81 R17.1 12.7,63.5 16.51,67.31 v38.1,67.31 48.26,67.31 50.8,64.77 50.8,63.54 U1.10 | J4.3 56.51,15.88 46.99,25.4 46.99,40.64 38.1,49.53 v38.1,52.07
  Bottom 0.305: J5.3 34.92,64.13 v38.1,67.31 | v38.1,52.07 38.1,52.35 35.05,55.4 35.05,58.32 34.92,58.45
SDA_1V8  (via drill 0.3)
  Top 0.305: R21.1 7.72,60.01 Q6.2 8.89,59.74 8.89,59.69 9.14,59.94 9.14,59.44 8.89,59.18 v8.38,59.18 | J3.3 10.79,12.05 v10.16,11.43
  Bottom 0.305: v10.16,11.43 7.62,11.43 2.54,16.51 2.54,57.15 5.08,59.69 7.87,59.69 v8.38,59.18
VBAT+
  Top 0.305: C7.1 13.46,26.42 13.97,25.91 | 13.97,25.15 13.79,25.15 U3.5
  Top 1.27: J2.+ 16.02,32.75 D1.A
  Top 2.54: D1.A 16.51,28.45 13.97,25.91 13.97,25.15 14.22,24.89 14.22,25.4 16.76,27.94 16.76,31.5 15.49,32.77 15.49,33.02 14.48,34.04 10.92,34.04 10.41,33.53
VBUS  (via drill 0.3)
  Top 0.305: U3.4 14.17,18.49 14.48,18.8 | C6.1 15.41,18.96 15.24,18.8 | LED2.A 6.34,21.58 v7.62,22.86
  Top 0.61: U3.8 9.45,24.69 v7.62,22.86 | v16.51,16.51 17.91,16.51 19.05,17.65
  Top 1.27: J1.+ 19.05,17.65 16.89,17.65 15.75,18.8 15.24,18.8 14.48,18.8 13.97,18.8 13.72,18.54
  Bottom 0.61: v7.62,22.86 7.62,19.05 8.89,17.78 15.24,17.78 v16.51,16.51
VCC  (via drill 0.3)  (1 unrouted)
  Top 0.203: R11.2 37.95,29.87 38.1,30.02 38.14,30.06 C15.1 C14.1 | 58.7,12.5 58.75,12.5 58.95,12.7
  Top 0.305: R9.2 61.7,15.49 58.75,12.55 58.7,12.5 58.04,11.84 55.4,11.84 53.98,13.26 53.98,13.89 J4.1
  Top 0.61: J4.1 53.34,13.97 49.02,18.29 37.59,18.29 27.94,27.94 27.94,31.75 | 37.59,55.14 39.88,57.43 39.88,58.3 J5.1
  Top 0.813: 31.66,54.1 36.32,54.1 39.37,57.15 39.42,57.15 40.13,57.86 40.13,58.37 39.98,58.52
  Top 1.016: 27.94,53.34 28.7,54.1 31.66,54.1 | 27.94,53.34 27.94,54.36 27.69,54.61 v20.57,54.61 v17.27,54.61 | Q1.3 6.01,55.46 v5.84,55.63 5.84,54.86 6.1,54.61 v6.35,54.61 | 27.94,53.34 27.94,31.75 27.94,30.48 28.4,30.02 38.1,30.02 U5.13
  Bottom 1.016: v6.35,54.61 v20.57,54.61
  Bottom 1.27: v20.57,54.61 v17.27,54.61 | v6.35,54.61 6.35,55.12 v5.84,55.63
VDD  (via drill 0.3)
  Top 0.305: C8.1 10.16,43.18 9.84,43.5 U4.1 8.67,42.96 v7.62,41.91 | U4.3 8.67,46.2 v8.64,46.23
  Top 1.27: Q2.3 12.11,43.86 11.43,43.18 10.16,43.18 8.89,43.18
  Bottom 0.305: v7.62,41.91 7.11,41.91 6.86,42.16 6.86,45.47 7.62,46.23 v8.64,46.23
VIN_I
  Top 0.305: 21.59,36.83 21.67,36.83 S1.1
  Top 2.54: D1.C 16.76,36.82 21.59,36.83
VIN_O  (via drill 0.3)  (1 unrouted)
  Top 0.305: R15.2 16.93,45.3 C13.1 15.49,45.47 15.75,45.72 | 15.75,46.99 15.58,46.99 C12.1 | 14.99,50.55 14.99,50.84 U2.1
  Top 0.61: 14.99,50.55 13.97,51.56 13.97,52.58 14.48,53.09 15.2,53.09 U2.3 | P1.1 68.33,41.91 68.83,41.4 68.83,19.05 66.29,16.51 v66.04,16.51 | v24.13,34.29 S1.2
  Top 1.016: C4.1 19.06,51.22 19.07,51.23
  Top 1.27: C13.1 14.31,45.3 Q2.2 | C12.1 15.33,49.53 | 15.33,49.53 C4.1 | 15.33,49.53 15.33,50.2 14.99,50.55
  Top 1.93: S1.2 24.13,43.18 20.32,46.99 15.75,46.99 15.75,45.72
  Bottom 0.61: v66.04,16.51 26.67,16.51 24.13,19.05 v24.13,34.29
WIFI_RST  (via drill 0.3)
  Top 0.305: R3.1 44.7,68.83 v44.45,68.58 | v46.99,64.77 48.01,64.77 48.26,64.52 48.26,63.54 U1.12 48.44,61.14 v48.26,60.96 | v29.21,33.02 29.21,32 29.72,31.5 30.42,31.5 WIFI.2
  Bottom 0.305: v44.45,68.58 44.45,67.31 v46.99,64.77 | v48.26,60.96 48.26,58.42 45.72,55.88 45.72,49.53 37.64,42.06 31.29,42.06 29.21,39.37 v29.21,33.02

### Text on the board
tPlace: SCL | SDA | GND | VCC | LUX | VCC | GND | BAT | RXD | TXD | B+ | BOOT | B- | RST | ON | OFF | + | - | 1V8 | SCL | 3V3 | SCL | SOLAR | CO2 | T&H
bPlace: SenseLoRa Industrial-grade Air Monitor V1.0 | www.makerfabs.com